# Altium project EBC.PrjPCB
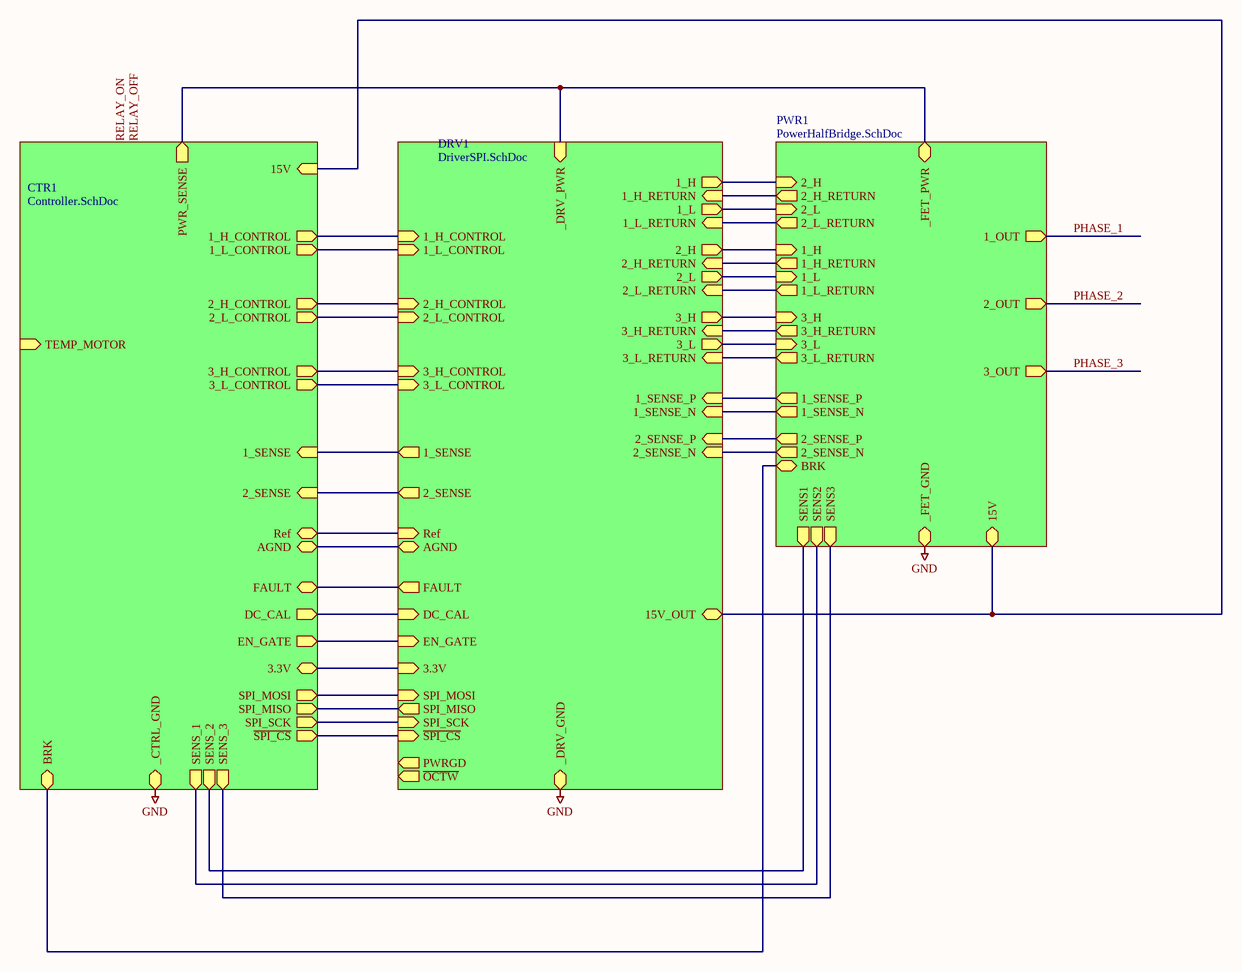
[diagram p0: Main.SchDoc]
4 sheets, 145 parts. Net scope: hierarchical (ports join the sheet entries above them; power ports are global).
Board file: EBC.PcbDoc
Sheets:
  Main.SchDoc
    PWR1 = PowerHalfBridge.SchDoc
    DRV1 = DriverSPI.SchDoc
    CTR1 = Controller.SchDoc

## Sheet Main.SchDoc
size A3; PageSetup: Record=PageOptions|CenterHorizontal=True|CenterVertical=True|PrintScale=0.67|XCorrection=1.00|YCorrection=1.00|PrintKind=2|BorderSize=5000000|LeftOffset=0|BottomOffset=0|Orientation=2|PaperLength=2970|PaperWidth=2100|Scale=100|PaperSource=7|PrintQuality=300|MediaType=1|DitherType=2|PrintScaleMode=1|PaperKind=A4|PaperIndex=9; Scale: 1:1; DocumentType: Схема электрическая принципиальная; FirstReferrence: АБВГ.123456.001

### Sub-sheets
CTR1 = Controller.SchDoc: FAULT, 1_L_CONTROL (out), 2_L_CONTROL (out), 3_L_CONTROL (out), DC_CAL (out), SPI_SCK (out), PWR_SENSE (out), 3_H_CONTROL (out), 2_H_CONTROL (out), 1_H_CONTROL (out), SPI_MOSI (out), ~{SPI_CS} (out), 1_SENSE (in), 2_SENSE (in), 15V (in), EN_GATE (out), _CTRL_GND, 3.3V, Ref, AGND, SPI_MISO (out), SENS_1 (out), SENS_2 (out), SENS_3 (out), TEMP_MOTOR (in), BRK
DRV1 = DriverSPI.SchDoc: 2_H (out), 1_H (out), 3_H (out), 2_L (out), 1_L (out), 3_L (out), 1_SENSE_P (in), 1_SENSE_N (in), 2_SENSE_P (in), 2_SENSE_N (in), 2_H_RETURN (in), 2_L_RETURN (in), 1_H_RETURN (in), 3_H_RETURN (in), 1_L_RETURN (in), 3_L_RETURN (in), 2_H_CONTROL (in), 2_L_CONTROL (in), 1_H_CONTROL (in), 1_L_CONTROL (in), 3_H_CONTROL (in), 3_L_CONTROL (in), 1_SENSE (out), 2_SENSE (out), _DRV_PWR (in), _DRV_GND (bidir), Ref (in), AGND (bidir), 15V_OUT, FAULT (out), EN_GATE (in), DC_CAL (in), 3.3V (in), SPI_MOSI (in), SPI_MISO (out), ~{SPI_CS} (in), SPI_SCK (in), PWRGD (out), ~{OCTW} (out)
PWR1 = PowerHalfBridge.SchDoc: 1_H (in), 2_H (in), 3_H (in), 1_L (in), 2_L (in), 3_L (in), 1_SENSE_P (out), 1_SENSE_N (out), 2_SENSE_N (out), 2_SENSE_P (out), _FET_PWR, _FET_GND, 1_OUT (out), 2_OUT (out), 3_OUT (out), 1_H_RETURN (out), 1_L_RETURN (out), 2_H_RETURN (out), 3_H_RETURN (out), 2_L_RETURN (out), 3_L_RETURN (out), SENS1 (out), SENS2 (out), SENS3 (out), 15V, BRK

### Nets
GND: sheet PWR1/_FET_GND, sheet PWR1/2_L_RETURN, sheet DRV1/1_L_RETURN, sheet DRV1/_DRV_GND, sheet CTR1/_CTRL_GND  [project net _CTRL_GND]
1_H_CONTROL: sheet DRV1/1_H_CONTROL, sheet CTR1/1_H_CONTROL
1_L_CONTROL: sheet DRV1/1_L_CONTROL, sheet CTR1/1_L_CONTROL
1_SENSE: sheet DRV1/1_SENSE, sheet CTR1/1_SENSE
2_H_CONTROL: sheet DRV1/2_H_CONTROL, sheet CTR1/2_H_CONTROL
2_L_CONTROL: sheet DRV1/2_L_CONTROL, sheet CTR1/2_L_CONTROL
2_SENSE: sheet DRV1/2_SENSE, sheet CTR1/2_SENSE
3_H_CONTROL: sheet DRV1/3_H_CONTROL, sheet CTR1/3_H_CONTROL
3_L_CONTROL: sheet DRV1/3_L_CONTROL, sheet CTR1/3_L_CONTROL
_3.3V: sheet DRV1/3.3V, sheet CTR1/3.3V
_AGND: sheet DRV1/AGND, sheet CTR1/AGND
_REF: sheet DRV1/Ref, sheet CTR1/Ref
BUCK: sheet PWR1/15V, sheet DRV1/15V_OUT, sheet CTR1/15V
DC_CAL: sheet DRV1/DC_CAL, sheet CTR1/DC_CAL
EN_GATE: sheet DRV1/EN_GATE, sheet CTR1/EN_GATE
FAULT: sheet DRV1/FAULT, sheet CTR1/FAULT
PHASE_1: sheet PWR1/1_OUT, sheet PWR1/1_H_RETURN, sheet DRV1/2_H_RETURN
PHASE_2: sheet PWR1/2_OUT, sheet PWR1/2_H_RETURN, sheet DRV1/1_H_RETURN
PHASE_3: sheet PWR1/3_OUT, sheet PWR1/3_H_RETURN, sheet DRV1/3_H_RETURN
~{SPI_CS}: sheet DRV1/~{SPI_CS}, sheet CTR1/~{SPI_CS}
SPI_MISO: sheet DRV1/SPI_MISO, sheet CTR1/SPI_MISO
SPI_MOSI: sheet DRV1/SPI_MOSI, sheet CTR1/SPI_MOSI
SPI_SCK: sheet DRV1/SPI_SCK, sheet CTR1/SPI_SCK
UH_P: sheet PWR1/1_H, sheet DRV1/2_H
UL_N: sheet PWR1/1_L_RETURN, sheet DRV1/2_L_RETURN
UL_P: sheet PWR1/1_L, sheet DRV1/2_L
VH_P: sheet PWR1/2_H, sheet DRV1/1_H
VL_P: sheet PWR1/2_L, sheet DRV1/1_L
WH_P: sheet PWR1/3_H, sheet DRV1/3_H
WL_N: sheet PWR1/3_L_RETURN, sheet DRV1/3_L_RETURN
WL_P: sheet PWR1/3_L, sheet DRV1/3_L
NetC46_2: sheet PWR1/_FET_PWR, sheet DRV1/_DRV_PWR, sheet CTR1/PWR_SENSE
NetIC1_14: sheet PWR1/SENS2, sheet CTR1/SENS_1
NetIC1_15: sheet PWR1/SENS1, sheet CTR1/SENS_2
NetIC1_16: sheet PWR1/SENS3, sheet CTR1/SENS_3
NetIC1_62: sheet PWR1/BRK, sheet CTR1/BRK
NetNT2_1: sheet PWR1/1_SENSE_P, sheet DRV1/1_SENSE_P
NetNT3_1: sheet PWR1/1_SENSE_N, sheet DRV1/1_SENSE_N
NetNT4_1: sheet PWR1/2_SENSE_P, sheet DRV1/2_SENSE_P
NetNT5_1: sheet PWR1/2_SENSE_N, sheet DRV1/2_SENSE_N

### Notes on the sheet
- Labels drawn without touching a wire or pin: RELAY_OFF, RELAY_ON
- Title
- Size:
- Date:
- A3
- Number:
- Time:
- Revision:
- Sheet
- of
- File:

## Sheet PowerHalfBridge.SchDoc
size A3
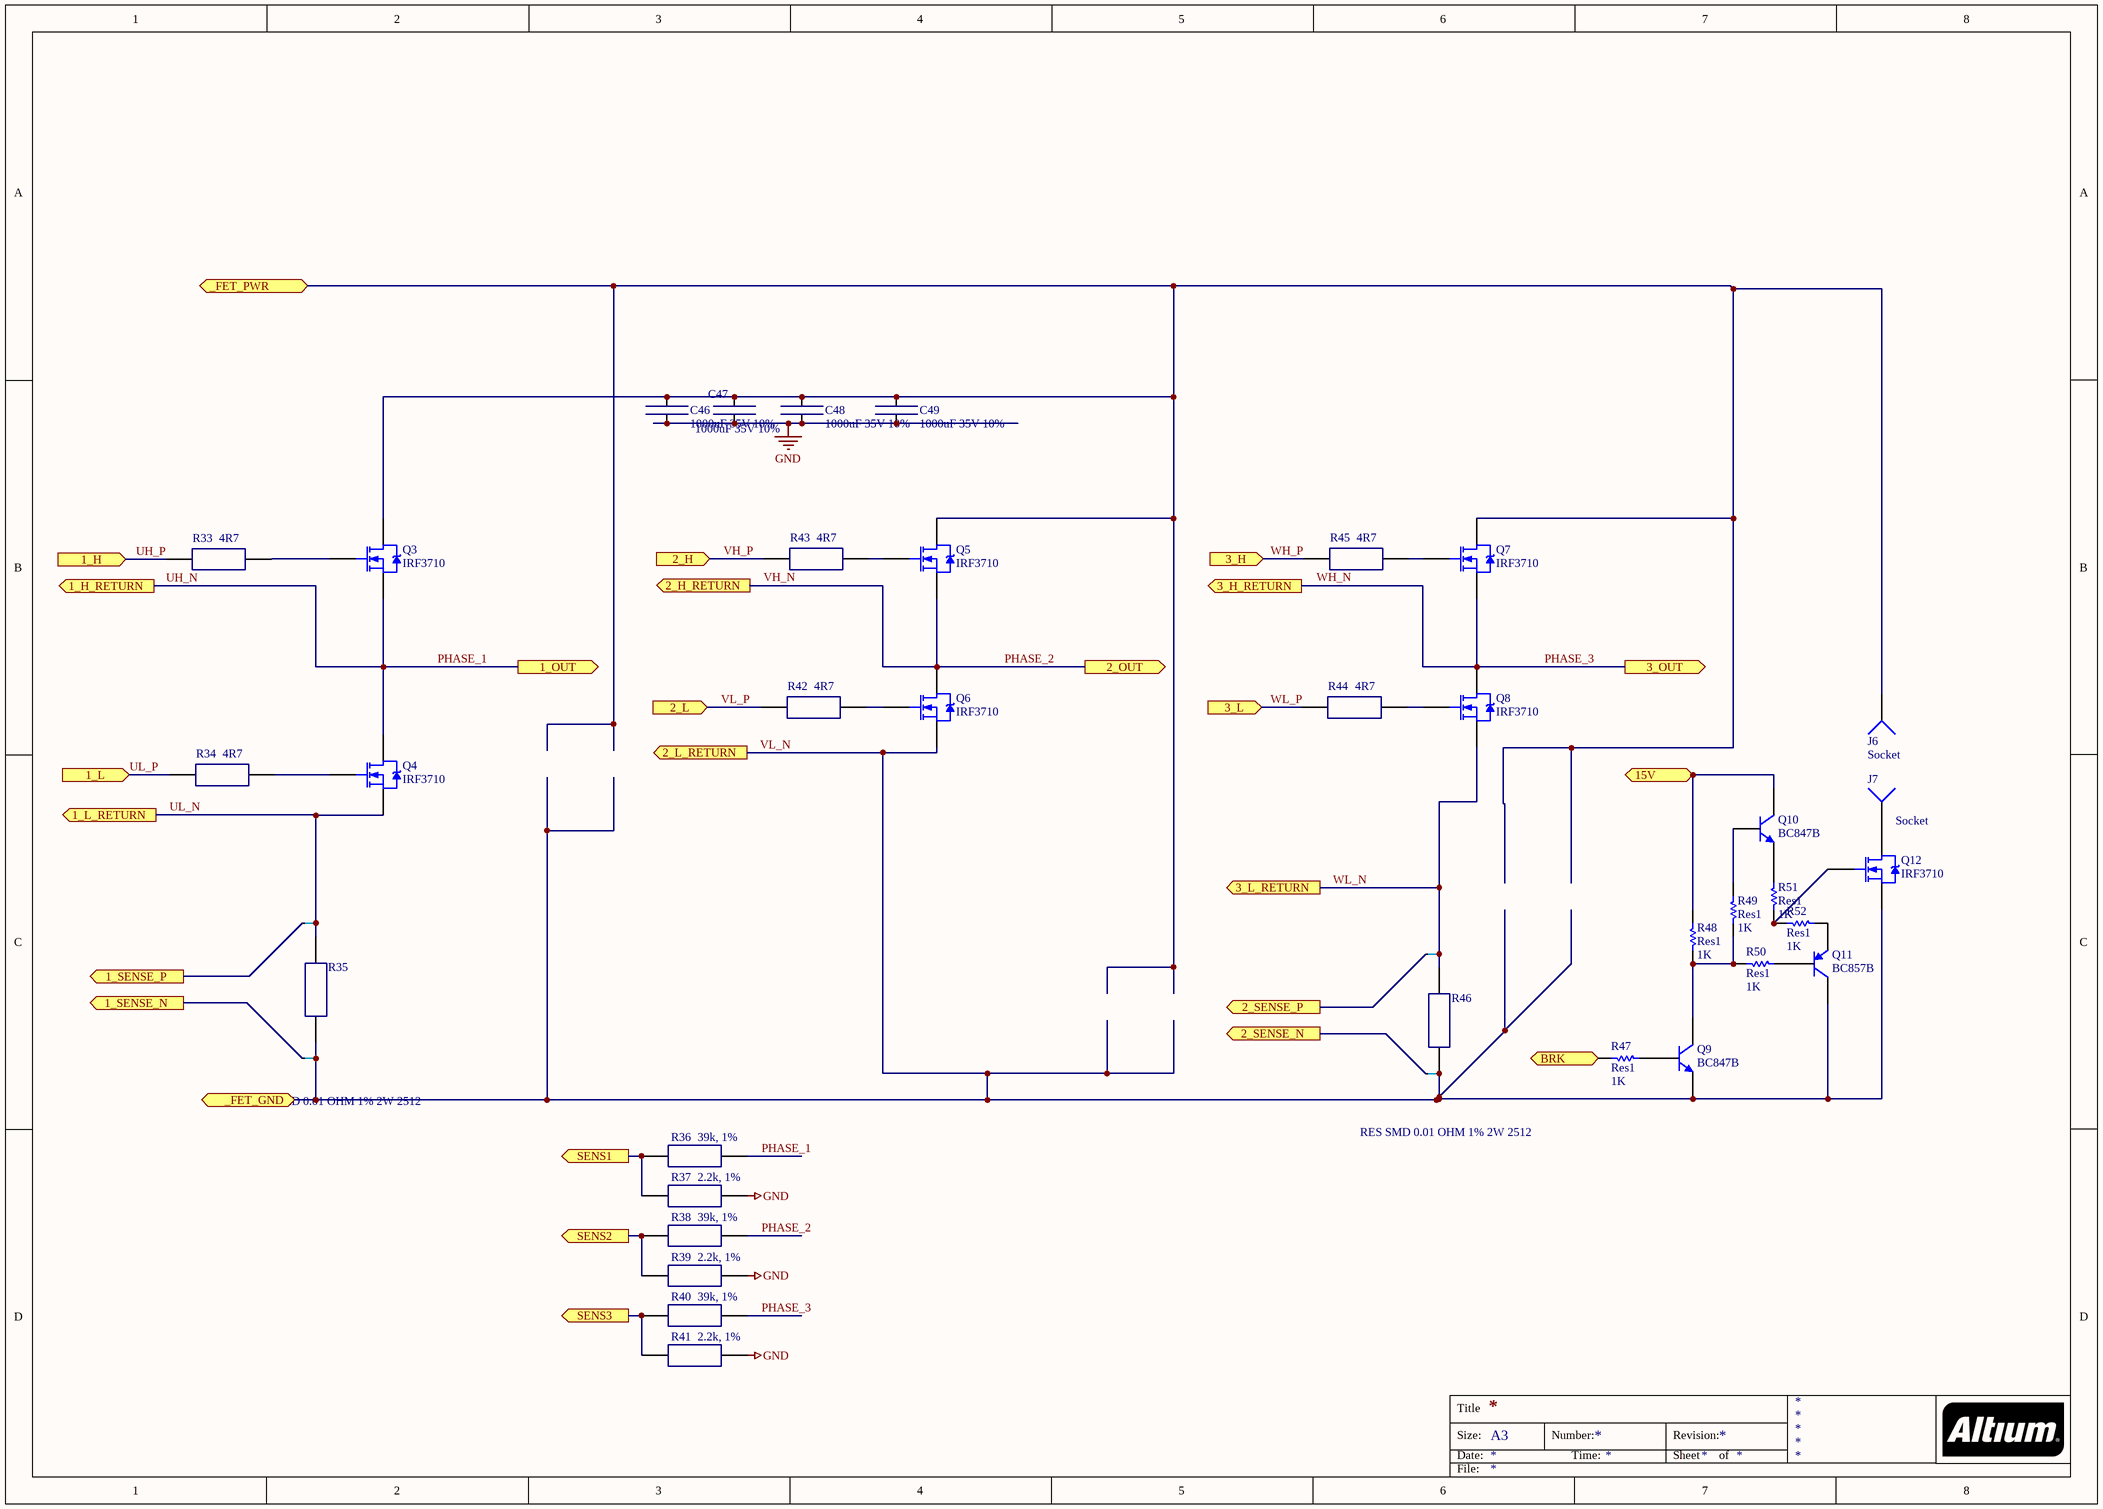
[diagram p1: PowerHalfBridge.SchDoc]

### Parts
C46  1000uF 35V 10%  [CAP_1mF_63V]
C47  1000uF 35V 10%  [CAP_1mF_63V]
C48  1000uF 35V 10%  [CAP_1mF_63V]
C49  1000uF 35V 10%  [CAP_1mF_63V]
J6  Socket  [PIN1]
J7  Socket  [PIN1]
NT2  NET_TIE  [NET_TIE_10mil]  (value not drawn)  (net tie, no BOM)
NT3  NET_TIE  [NET_TIE_10mil]  (value not drawn)  (net tie, no BOM)
NT4  NET_TIE  [NET_TIE_10mil]  (value not drawn)  (net tie, no BOM)
NT5  NET_TIE  [NET_TIE_10mil]  (value not drawn)  (net tie, no BOM)
Q3  IRF3710  [TO-220AB_LOW]
Q4  IRF3710  [TO-220AB_LOW]
Q5  IRF3710  [TO-220AB_LOW]
Q6  IRF3710  [TO-220AB_LOW]
Q7  IRF3710  [TO-220AB_LOW]
Q8  IRF3710  [TO-220AB_LOW]
Q9  BC847B  [SOT23_N]
Q10  BC847B  [SOT23_N]
Q11  BC857B  [SOT-23A_N]
Q12  IRF3710  [TO-220AB_LOW]
R33  4R7  [0603x]
R34  4R7  [RESC1608X05N(0603)]
R35  RES SMD 0.01 OHM 1% 2W 2512  [1T-2512]
R36  39k, 1%  [0805x]
R37  2.2k, 1%  [0805x]
R38  39k, 1%  [0805x]
R39  2.2k, 1%  [0805x]
R40  39k, 1%  [0805x]
R41  2.2k, 1%  [0805x]
R42  4R7  [RESC1608X05N(0603)]
R43  4R7  [RESC1608X05N(0603)]
R44  4R7  [RESC1608X05N(0603)]
R45  4R7  [RESC1608X05N(0603)]
R46  RES SMD 0.01 OHM 1% 2W 2512  [1T-2512]
R47  Res1  value 1K  [0603x]
R48  Res1  value 1K  [0603x]
R49  Res1  value 1K  [0603x]
R50  Res1  value 1K  [0603x]
R51  Res1  value 1K  [0603x]
R52  Res1  value 1K  [0603x]

### Ports
1_H (in), 1_H_RETURN (out), 1_L (in), 1_L_RETURN (out), 1_OUT (out), 1_SENSE_N (out), 1_SENSE_P (out), 2_H (in), 2_H_RETURN (out), 2_L (in), 2_L_RETURN (out), 2_OUT (out), 2_SENSE_N (out), 2_SENSE_P (out), 3_H (in), 3_H_RETURN (out), 3_L (in), 3_L_RETURN (out), 3_OUT (out), 15V, _FET_GND, _FET_PWR, BRK, SENS1 (out), SENS2 (out), SENS3 (out)

### Nets
GND: C46.1 C47.2 C48.1 C49.2 NT3.2 NT5.2 Q6.3(S) Q9.2(E) Q11.3(C) Q12.3(S) R35.2 R37.2 R39.2 R41.2 R46.2 ; port 2_L_RETURN, port _FET_GND  [also labelled VL_N]  [project net _CTRL_GND]
BUCK: Q10.3(C) R48.1 ; port 15V
PHASE_1: Q3.3(S) Q4.2(D) R36.2 ; port 1_H_RETURN, port 1_OUT  [also labelled UH_N]
PHASE_2: Q5.3(S) Q6.2(D) R38.2 ; port 2_OUT, port 2_H_RETURN  [also labelled VH_N]
PHASE_3: Q7.3(S) Q8.2(D) R40.2 ; port 3_OUT, port 3_H_RETURN  [also labelled WH_N]
UH_P: R33.1 ; port 1_H
UL_N: NT2.2 Q4.3(S) R35.1 ; port 1_L_RETURN
UL_P: R34.1 ; port 1_L
VH_P: R43.1 ; port 2_H
VL_P: R42.1 ; port 2_L
WH_P: R45.1 ; port 3_H
WL_N: NT4.2 Q8.3(S) R46.1 ; port 3_L_RETURN
WL_P: R44.1 ; port 3_L
NetC46_2: C46.2 C47.1 C48.2 C49.1 J6.1 Q3.2(D) Q5.2(D) Q7.2(D) ; port _FET_PWR
NetIC1_14: R38.1 R39.1 ; port SENS2
NetIC1_15: R36.1 R37.1 ; port SENS1
NetIC1_16: R40.1 R41.1 ; port SENS3
NetIC1_62: R47.1 ; port BRK
NetJ7_1: J7.1 Q12.2(D)
NetNT2_1: NT2.1 ; port 1_SENSE_P
NetNT3_1: NT3.1 ; port 1_SENSE_N
NetNT4_1: NT4.1 ; port 2_SENSE_P
NetNT5_1: NT5.1 ; port 2_SENSE_N
NetQ3_1: Q3.1(G) R33.2
NetQ4_1: Q4.1(G) R34.2
NetQ5_1: Q5.1(G) R43.2
NetQ6_1: Q6.1(G) R42.2
NetQ7_1: Q7.1(G) R45.2
NetQ8_1: Q8.1(G) R44.2
NetQ9_1: Q9.1(B) R47.2
NetQ9_3: Q9.3(C) R48.2 R49.2 R50.1
NetQ10_1: Q10.1(B) R49.1
NetQ10_2: Q10.2(E) R51.2
NetQ11_1: Q11.1(B) R50.2
NetQ11_2: Q11.2(E) R52.2
NetQ12_1: Q12.1(G) R51.1 R52.1

### Notes on the sheet
- Title
- Size:
- Date:
- A3
- Number:
- Time:
- Revision:
- Sheet
- of
- File:

### Library data of the parts
C46-C49 = Ceramic Chip Capacitor: Value: CAP CER 0.022UF 50V X7R 0402; Order Number: GRM155R71H223KA12D; Distributor: Murata Electronics; Package: 0402
NT2-NT5 = Net tie
Q3-Q8 Q12 = IRF3710: HEXFET Power MOSFET; Note: Pin 2 is electrically connected to pin 4.; Sim Note: Thermal Model provided is not called on from main Subckt.; Published: 8-Jun-2000; LatestRevisionDate: 17-Jul-2002; LatestRevisionNote: Re-released for DXP Platform.; DatasheetVersion: May-1998; PackageVersion: Feb-1997; PackageReference: TO-220AB; Publisher: Altium Limited; PackageDescription: TO, Thru-Hole, Vertical, Heatsink Mounted; 3 In-Line Leads; Pitch 2.54 mm; ComponentLink1Description: Manufacturer Link; ComponentLink1URL: http://www.irf.com/; ComponentLink2Description: Datasheet; ComponentLink2URL: http://www.irf.com/product-info/datasheets/data/irf3710.pdf
Q9 Q10 = BC847B: NPN General-purpose Transistor; Published: 17-Sep-2003; LatestRevisionDate: 12-Dec-2006; LatestRevisionNote: IPC-7351 Footprint Added.; DatasheetVersion: 4-Feb-2002; PackageVersion: May-1999; PackageReference: SOT23; Publisher: Altium Limited; PackageDescription: 3-Pin SOT-23 Package 0.95 mm Pitch, 2.3 mm Lead Span; ComponentLink1Description: Manufacturer Link; ComponentLink1URL: http://www.semiconductors.philips.com/; ComponentLink2Description: Datasheet; ComponentLink2URL: http://www.semiconductors.philips.com/acrobat/datasheets/BC846_BC847_BC848_5.pdf
Q11 = BC857B: PNP General Purpose Amplifier; Published: 8-Jun-2000; LatestRevisionDate: 20-Nov-2009; LatestRevisionNote: IPC-7351 Footprint Added.; DatasheetVersion: 1997; PackageVersion: Sep-1998; PackageReference: SOT-23A; Publisher: Altium Limited; PackageDescription: 3-Pin SOT-23 Package 0.95 mm Pitch, 2.3 mm Lead Span; ComponentLink1Description: Manufacturer Link; ComponentLink1URL: http://www.fairchildsemi.com/; ComponentLink2Description: Datasheet; ComponentLink2URL: http://www.fairchildsemi.com/ds/BC%2FBC857.pdf
R33 R34 R42-R45 = SMD: Value: RES SMD 4.7 OHM 5% 1/10W 0603; Order Number: ERJ-3GEYJ4R7V; Distributor: Panasonic
  R33 R34 R42 R44 R45: Package: RESC1608X05N(0603)
  R43: Package: 0603
R35 R46 = SMD: Order Number: WSL2512R0100FEA; Value: RES SMD 0.01 OHM 1% 2W 2512; Package: 2512; Distributor: Vishay Dale
R36 R38 R40 = SMD: Order Number: ERJ-3EKF3902V; Value: 39k, 1%; Package: RESC1608X05N(0603); Distributor: Panasonic
R37 R39 R41 = SMD: Order Number: ERJ-3EKF2201V; Value: 2.2k, 1%; Package: RESC1608X05N(0603); Distributor: Panasonic
R47-R52 = Res1: Resistor; Published: 8-Jun-2000; LatestRevisionDate: 17-Jul-2002; LatestRevisionNote: Re-released for DXP Platform.; PackageReference: AXIAL-0.3; Publisher: Altium Limited; PackageDescription: Axial Device, Thru-Hole; 2 Leads; 0.3 in Pin Spacing
J6 J7 = Socket: LatestRevisionDate: 17-Jul-2002; LatestRevisionNote: Re-released for DXP Platform.; Publisher: Altium Limited

## Sheet DriverSPI.SchDoc
size A4
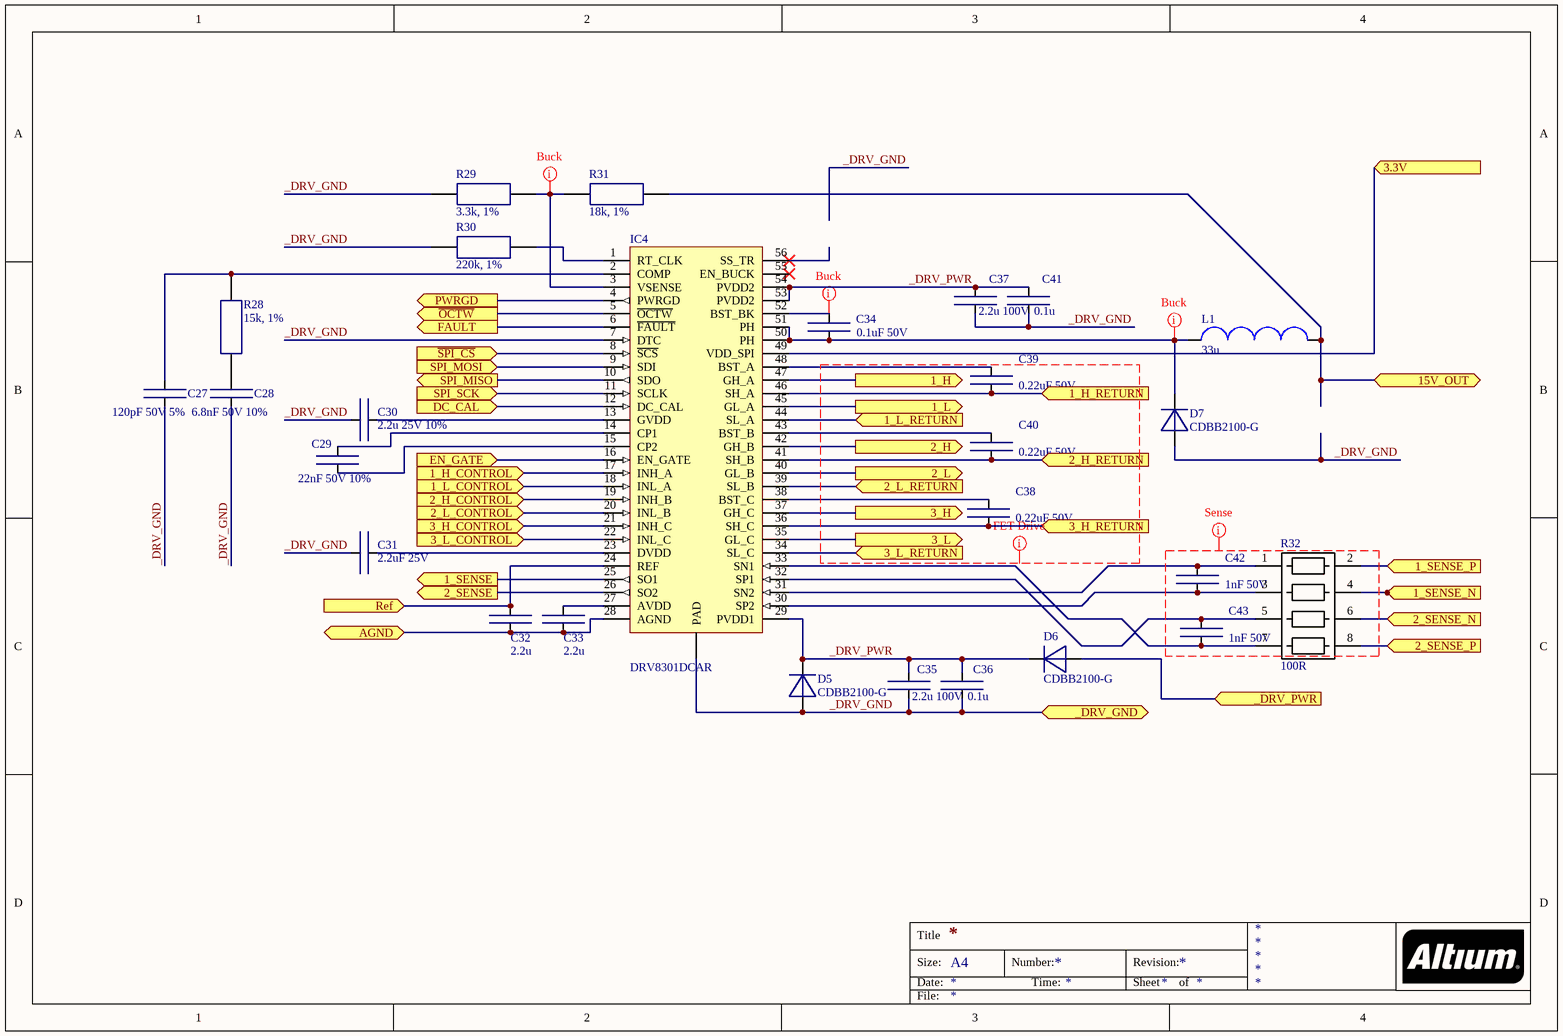
[diagram p2: DriverSPI.SchDoc]

### Parts
C27  120pF 50V 5%  [0402small]
C28  6.8nF 50V 10%  [0402small]
C29  22nF 50V 10%  [0402small]
C30  2.2u 25V 10%  [CAPC1608X08N(0603)]
C31  2.2uF 25V  [0603x]
C32  2.2u  [0603x]
C33  2.2u  [CAPC1608X08N(0603)]
C34  0.1uF 50V  [0402small]
C35  2.2u 100V  [EIA CC1210]
C36  0.1u  [C0805]
C37  2.2u 100V  [EIA CC1210]
C38  0.22uF 50V  [0402small]
C39  0.22uF 50V  [0402small]
C40  0.22uF 50V  [0402small]
C41  0.1u  [C0805]
C42  1nF 50V  [0402small]
C43  1nF 50V  [0402small]
D5  CDBB2100-G  [SMB_real]
D6  CDBB2100-G  [SMB_real]
D7  CDBB2100-G  [SMB_real]
IC4  DRV8301DCAR  [HTSSOP56(L)]
L1  33u  [DR74]
R28  15k, 1%  [0402small]
R29  3.3k, 1%  [0402small]
R30  220k, 1%  [0402small]
R31  18k, 1%  [0402small]
R32  100R  [RES_ARRAY_4X]

### Ports
1_H (out), 1_H_CONTROL (in), 1_H_RETURN (in), 1_L (out), 1_L_CONTROL (in), 1_L_RETURN (in), 1_SENSE (out), 1_SENSE_N (in), 1_SENSE_P (in), 2_H (out), 2_H_CONTROL (in), 2_H_RETURN (in), 2_L (out), 2_L_CONTROL (in), 2_L_RETURN (in), 2_SENSE (out), 2_SENSE_N (in), 2_SENSE_P (in), 3.3V (in), 3_H (out), 3_H_CONTROL (in), 3_H_RETURN (in), 3_L (out), 3_L_CONTROL (in), 3_L_RETURN (in), 15V_OUT, _DRV_GND (bidir), _DRV_PWR (in), AGND (bidir), DC_CAL (in), EN_GATE (in), FAULT (out), PWRGD (out), Ref (in), SPI_MISO (out), SPI_MOSI (in), SPI_SCK (in), ~{OCTW} (out), ~{SPI_CS} (in)

### Nets
_DRV_GND: C27.1 C28.1 C30.1 C31.2 C35.2 C36.2 C37.2 C41.2 D5.1 D7.1 IC4.7(DTC) IC4.44(SL_A) IC4.57(PAD) R29.2 R30.2 ; port 1_L_RETURN, port _DRV_GND  [project net _CTRL_GND]
1_H_CONTROL: IC4.17(INH_A) ; port 1_H_CONTROL
1_L_CONTROL: IC4.18(INL_A) ; port 1_L_CONTROL
1_SENSE: IC4.25(SO1) ; port 1_SENSE
2_H_CONTROL: IC4.19(INH_B) ; port 2_H_CONTROL
2_L_CONTROL: IC4.20(INL_B) ; port 2_L_CONTROL
2_SENSE: IC4.26(SO2) ; port 2_SENSE
3_H_CONTROL: IC4.21(INH_C) ; port 3_H_CONTROL
3_L_CONTROL: IC4.22(INL_C) ; port 3_L_CONTROL
_3.3V: IC4.49(VDD_SPI) ; port 3.3V
_AGND: C32.2 C33.2 IC4.28(AGND) ; port AGND
_DRV_PWR: C35.1 C36.1 C37.1 C41.1 D5.2 D6.2 IC4.29(PVDD1) IC4.53(PVDD2) IC4.54(PVDD2)
_REF: C32.1 IC4.24(REF) ; port Ref
BUCK: L1.2 R31.1 ; port 15V_OUT
DC_CAL: IC4.12(DC_CAL) ; port DC_CAL
EN_GATE: IC4.16(EN_GATE) ; port EN_GATE
FAULT: IC4.6(~{FAULT}) ; port FAULT
PHASE_1: C40.1 IC4.41(SH_B) ; port 2_H_RETURN
PHASE_2: C39.1 IC4.46(SH_A) ; port 1_H_RETURN
PHASE_3: C38.1 IC4.36(SH_C) ; port 3_H_RETURN
~{SPI_CS}: IC4.8(~{SCS}) ; port ~{SPI_CS}
SPI_MISO: IC4.10(SDO) ; port SPI_MISO
SPI_MOSI: IC4.9(SDI) ; port SPI_MOSI
SPI_SCK: IC4.11(SCLK) ; port SPI_SCK
UH_P: IC4.42(GH_B) ; port 2_H
UL_N: IC4.39(SL_B) ; port 2_L_RETURN
UL_P: IC4.40(GL_B) ; port 2_L
VH_P: IC4.47(GH_A) ; port 1_H
VL_P: IC4.45(GL_A) ; port 1_L
WH_P: IC4.37(GH_C) ; port 3_H
WL_N: IC4.34(SL_C) ; port 3_L_RETURN
WL_P: IC4.35(GL_C) ; port 3_L
NetC27_2: C27.2 IC4.2(COMP) R28.2
NetC28_2: C28.2 R28.1
NetC29_1: C29.1 IC4.14(CP1)
NetC29_2: C29.2 IC4.15(CP2)
NetC30_2: C30.2 IC4.13(GVDD)
NetC31_1: C31.1 IC4.23(DVDD)
NetC33_1: C33.1 IC4.27(AVDD)
NetC34_1: C34.1 D7.2 IC4.50(PH) IC4.51(PH) L1.1
NetC34_2: C34.2 IC4.52(BST_BK)
NetC38_2: C38.2 IC4.38(BST_C)
NetC39_2: C39.2 IC4.48(BST_A)
NetC40_2: C40.2 IC4.43(BST_B)
NetC42_1: C42.1 IC4.30(SP2) R32.3
NetC42_2: C42.2 IC4.31(SN2) R32.1
NetC43_1: C43.1 IC4.33(SN1) R32.7
NetC43_2: C43.2 IC4.32(SP1) R32.5
NetC46_2: D6.1 ; port _DRV_PWR
NetIC4_1: IC4.1(RT_CLK) R30.1
NetIC4_3: IC4.3(VSENSE) R29.1 R31.2
NetIC4_4: IC4.4(PWRGD) ; port PWRGD
NetIC4_5: IC4.5(~{OCTW}) ; port ~{OCTW}
NetNT2_1: R32.2 ; port 1_SENSE_P
NetNT3_1: R32.4 ; port 1_SENSE_N
NetNT4_1: R32.8 ; port 2_SENSE_P
NetNT5_1: R32.6 ; port 2_SENSE_N

Not connected (* = marked no-connect by the designer): IC4 55(EN_BUCK)* 56(SS_TR)*

### Layout directives
net class Sense: (no net found under the mark)
net class FET Drive: (no net found under the mark)
net class Buck: NetC34_1, NetC34_2, NetIC4_3

### Notes on the sheet
- Title
- Size:
- Date:
- A4
- Number:
- Time:
- Revision:
- Sheet
- of
- File:

### Library data of the parts
C27 = Ceramic Chip Capacitor: Value: CAP CER 120PF 50V NP0 0402; Order Number: C0402C121J5GACTU; Distributor: Panasonic; Package: 0402
C28 = Ceramic Chip Capacitor: Value: CAP CER 6800PF 50V X7R 0402; Order Number: GRM155R71H682KA88D; Distributor: Murata; Package: 0402
C29 = Ceramic Chip Capacitor: as C46 on sheet PowerHalfBridge; Distributor: Murata Electronics; Package: 0402
C30-C33 = Ceramic Chip Capacitor: Value: CAP CER 2.2UF 25V X5R 0603; Order Number: GRM188R61E225KA12D; Distributor: Murata Electronics; Package: 0603
C34 = Ceramic Chip Capacitor: Value: CAP CER 0.1UF 50V X5R 0402; Order Number: C1005X5R1H104K050BB; Distributor: TDK Corporation; Package: 0402
C35 C37 = Ceramic Chip Capacitor: Value: CAP CER 2.2UF 100V X7R 1210; Order Number: C1210X225K1RACAUTO; Distributor: KEMET; Package: 1210
C36 C41 = Ceramic Chip Capacitor: Value: CAP CER 0.1UF 100V X7R 0805; Order Number: C0805C104K1RACTU; Distributor: KEMET; Package: 0805
C38-C40 = Ceramic Chip Capacitor: Value: CAP CER 0.22UF 50V X5R 0402; Order Number: UMK105BJ224KV-F; Distributor: Taiyo Yuden; Package: 0402
C42 C43 = Ceramic Chip Capacitor: Value: CAP CER 1000PF 50V C0G 0402; Order Number: CGA2B2C0G1H102J050BD; Distributor: TDK Corporation; Package: 0402
D5-D7 = ES1A...D: Value: SCHOTTKY 100V 2A DO214AA; Order Number: CDBB2100-G; Distributor: Comchip Technology; Package: SMB
IC4 = DRV8301: Value: DRV 8301 - IC MOTOR CONTROLLER SPI 56HTSSOP; Distributor: Texas Instruments; Order Number: DRV8301DCAR; Package: HTSSOP56
L1 = DR74: Value: FIXED IND 33UH 1.41A 143 MOHM; Order Number: DR74-330-R; Distributor: Eaton; Package: Nonstandard
R28 = SMD: Value: RES SMD 15K OHM 1% 1/10W 0402; Order Number: ERJ-2RKF1502X; Package: 0402; Distributor: Panasonic
R29 = SMD: Value: RES SMD 3.3K OHM 1% 1/10W 0402; Order Number: ERJ-2RKF3301X; Package: 0402; Distributor: Panasonic
R30 = SMD: Value: RES SMD 220K OHM 1% 1/10W 0402; Order Number: ERJ-2RKF2203X; Package: 0402; Distributor: Panasonic
R31 = SMD: Value: RES SMD 18K OHM 1% 1/10W 0402; Order Number: ERJ-2RKF1802X; Package: 0402; Distributor: Panasonic
R32 = RES_Array_4x: 742C0431000FP; Order Number: EXB-38V101JV; Value: RES ARRAY 4 RES 100 OHM 1206; Distributor: Panasonic; Package: 1206 (3216 Metric)

## Sheet Controller.SchDoc
size A2
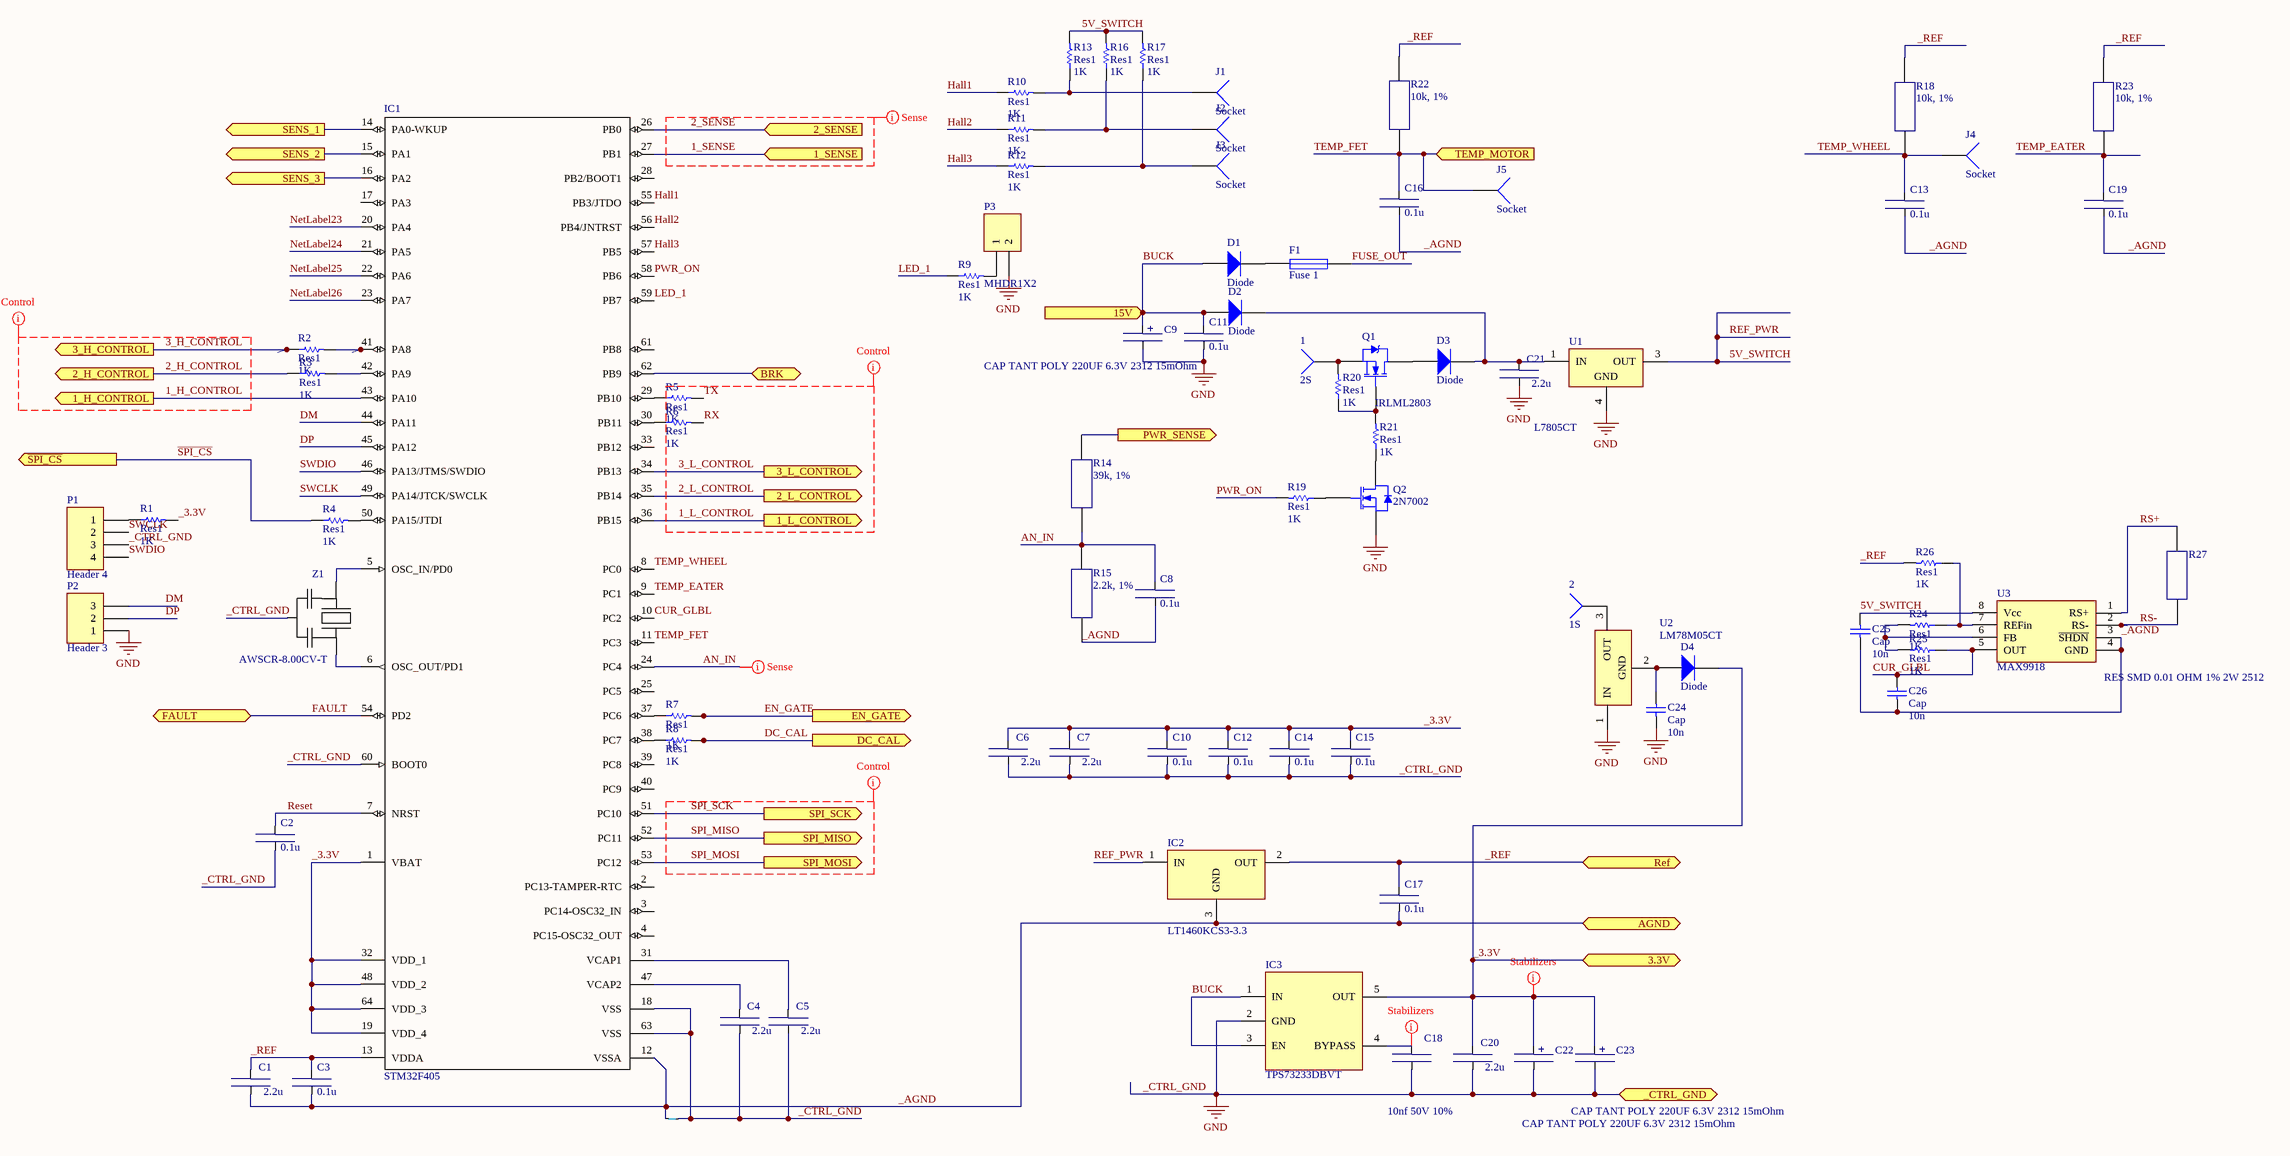
[diagram p3: Controller.SchDoc]

### Parts
1  2S  [PIN1]
2  1S  [PIN1]
C1  2.2u  [ERA-0603]
C2  0.1u  [CAPC1608X08N(0603)]
C3  0.1u  [ERA-0603]
C4  2.2u  [CAPC1608X08N(0603)]
C5  2.2u  [CAPC1608X08N(0603)]
C6  2.2u  [CAPC1608X08N(0603)]
C7  2.2u  [CAPC1608X08N(0603)]
C8  0.1u  [0603x]
C9  CAP TANT POLY 220UF 6.3V 2312 15mOhm  [CAP_POLY_330]
C10  0.1u  [CAPC1608X08N(0603)]
C11  0.1u  [ERA-0603]
C12  0.1u  [CAPC1608X08N(0603)]
C13  0.1u  [0603x]
C14  0.1u  [CAPC1608X08N(0603)]
C15  0.1u  [CAPC1608X08N(0603)]
C16  0.1u  [CAPC1608X08N(0603)]
C17  0.1u  [0603x]
C18  10nf 50V 10%  [0603x]
C19  0.1u  [0603x]
C20  2.2u  [CAPC1608X08N(0603)]
C21  2.2u  [0603x]
C22  CAP TANT POLY 220UF 6.3V 2312 15mOhm  [C]
C23  CAP TANT POLY 220UF 6.3V 2312 15mOhm  [CAP_POLY_330]
C24  Cap  value 10n  [ERA-0603]
C25  Cap  value 10n  [ERA-0603]
C26  Cap  value 10n  [ERA-0603]
D1  Diode  [SMB_real]
D2  Diode  [SMA]
D3  Diode  [SMA]
D4  Diode  [SMA]
F1  Fuse 1  [1812]
IC1  STM32F405  [LQFP64_L]
IC2  LT1460KCS3-3.3  [SOT23-3_L]
IC3  TPS73233DBVT  [SOT23-5_L]
J1  Socket  [PIN1]
J2  Socket  [PIN1]
J3  Socket  [PIN1]
J4  Socket  [PIN1]
J5  Socket  [PIN1]
NT1  NET_TIE  [NET_TIE_10mil]  (value not drawn)  (net tie, no BOM)
P1  Header 4  [MHDR1X4]
P2  Header 3  [HDR1X3]
P3  MHDR1X2  [MHDR1X2]
Q1  IRLML2803  [SOT-23_N]
Q2  2N7002  [SOT23_N]
R1  Res1  value 1K  [0603x]
R2  Res1  value 1K  [1206x]
R3  Res1  value 1K  [0603x]
R4  Res1  value 1K  [0603x]
R5  Res1  value 1K  [0402x]
R6  Res1  value 1K  [0402x]
R7  Res1  value 1K  [0805x]
R8  Res1  value 1K  [0603x]
R9  Res1  value 1K  [0603x]
R10  Res1  value 1K  [0603x]
R11  Res1  value 1K  [0603x]
R12  Res1  value 1K  [0603x]
R13  Res1  value 1K  [0603x]
R14  39k, 1%  [1206x]
R15  2.2k, 1%  [0603x]
R16  Res1  value 1K  [0603x]
R17  Res1  value 1K  [0603x]
R18  10k, 1%  [0603x]
R19  Res1  value 1K  [0603x]
R20  Res1  value 1K  [0603x]
R21  Res1  value 1K  [0603x]
R22  10k, 1%  [RESC1608X05N(0603)]
R23  10k, 1%  [0603x]
R24  Res1  value 1K  [0603x]
R25  Res1  value 1K  [0603x]
R26  Res1  value 1K  [0603x]
R27  RES SMD 0.01 OHM 1% 2W 2512  [1T-2512]
U1  L7805CT  [TO-252AA]
U2  LM78M05CT  [318-08]
U3  MAX9918  [SO8_M]
Z1  AWSCR-8.00CV-T  [CRYSTAL_CERAMIC]

### Ports
1_H_CONTROL (out), 1_L_CONTROL (out), 1_SENSE (in), 2_H_CONTROL (out), 2_L_CONTROL (out), 2_SENSE (in), 3.3V, 3_H_CONTROL (out), 3_L_CONTROL (out), 15V (in), _CTRL_GND, AGND, BRK, DC_CAL (out), EN_GATE (out), FAULT, PWR_SENSE (out), Ref, SENS_1 (out), SENS_2 (out), SENS_3 (out), SPI_MISO (out), SPI_MOSI (out), SPI_SCK (out), TEMP_MOTOR (in), ~{SPI_CS} (out)

### Nets
_CTRL_GND: C2.2 C4.2 C5.2 C6.2 C7.2 C9.2 C10.2 C11.2 C12.2 C14.2 C15.2 C18.2 C20.2 C21.2 C22.2 C23.2 C24.2 IC1.18(VSS) IC1.60(BOOT0) IC1.63(VSS) IC3.2(GND) NT1.2 P1.3 P2.1 P3.2 Q2.2(S) U1.4(GND) U2.1(IN) Z1.2(GND) ; port _CTRL_GND  [also labelled GND]
1_H_CONTROL: IC1.43(PA10) ; port 1_H_CONTROL
1_L_CONTROL: IC1.36(PB15) ; port 1_L_CONTROL
1_SENSE: IC1.27(PB1) ; port 1_SENSE
2_H_CONTROL: R3.1 ; port 2_H_CONTROL
2_L_CONTROL: IC1.35(PB14) ; port 2_L_CONTROL
2_SENSE: IC1.26(PB0) ; port 2_SENSE
3_H_CONTROL: R2.1 ; port 3_H_CONTROL
3_L_CONTROL: IC1.34(PB13) ; port 3_L_CONTROL
5V_SWITCH: C25.1 IC2.1(IN) R13.2 R16.2 R17.2 U1.3(OUT) U3.8(Vcc)  [also labelled REF_PWR]
_3.3V: C6.1 C7.1 C10.1 C12.1 C14.1 C15.1 C20.1 C22.1 C23.1 D4.2(K) IC1.1(VBAT) IC1.19(VDD_4) IC1.32(VDD_1) IC1.48(VDD_2) IC1.64(VDD_3) IC3.5(OUT) R1.2 ; port 3.3V
_AGND: C1.2 C3.2 C8.2 C13.2 C16.2 C17.2 C19.2 C25.2 C26.2 IC1.12(VSSA) IC2.3(GND) NT1.1 R15.2 U3.3(~{SHDN}) U3.4(GND) ; port AGND
_REF: C1.1 C3.1 C17.1 IC1.13(VDDA) IC2.2(OUT) R18.1 R22.1 R23.1 R26.2 ; port Ref
AN_IN: C8.1 IC1.24(PC4) R14.2 R15.1
BUCK: C9.1 C11.1 D1.1(A) D2.1(A) IC3.1(IN) IC3.3(EN) ; port 15V
CUR_GLBL: C26.1 IC1.10(PC2) R25.1 U3.5(OUT)
DC_CAL: R8.2 ; port DC_CAL
DM: IC1.44(PA11) P2.3
DP: IC1.45(PA12) P2.2
EN_GATE: R7.2 ; port EN_GATE
FAULT: IC1.54(PD2) ; port FAULT
FUSE_OUT: F1.2
Hall1: IC1.55(PB3/JTDO) R10.1
Hall2: IC1.56(PB4/JNTRST) R11.1
Hall3: IC1.57(PB5) R12.1
LED_1: IC1.59(PB7) R9.1
NetLabel23: IC1.20(PA4)
NetLabel24: IC1.21(PA5)
NetLabel25: IC1.22(PA6)
NetLabel26: IC1.23(PA7)
PWR_ON: IC1.58(PB6) R19.2
Reset: C2.1 IC1.7(NRST)
RS+: R27.1 U3.1(RS+)
RS-: R27.2 U3.2(RS-)
RX: R6.2
~{SPI_CS}: R4.1 ; port ~{SPI_CS}
SPI_MISO: IC1.52(PC11) ; port SPI_MISO
SPI_MOSI: IC1.53(PC12) ; port SPI_MOSI
SPI_SCK: IC1.51(PC10) ; port SPI_SCK
SWCLK: IC1.49(PA14/JTCK/SWCLK) P1.2
SWDIO: IC1.46(PA13/JTMS/SWDIO) P1.4
TEMP_EATER: C19.1 IC1.9(PC1) R23.2
TEMP_FET: C16.1 IC1.11(PC3) J5.1 R22.2 ; port TEMP_MOTOR
TEMP_WHEEL: C13.1 IC1.8(PC0) J4.1 R18.2
TX: R5.2
Net1_1: 1.1 Q1.2(S) R20.2
Net2_1: 2.1 U2.3(OUT)
NetC4_1: C4.1 IC1.47(VCAP2)
NetC5_1: C5.1 IC1.31(VCAP1)
NetC18_1: C18.1 IC3.4(BYPASS)
NetC21_1: C21.1 D2.2(K) D3.2(K) U1.1(IN)
NetC24_1: C24.1 D4.1(A) U2.2(GND)
NetC46_2: R14.1 ; port PWR_SENSE
NetD1_2: D1.2(K) F1.1
NetD3_1: D3.1(A) Q1.3(D)
NetIC1_5: IC1.5(OSC_IN/PD0) Z1.1(X1)
NetIC1_6: IC1.6(OSC_OUT/PD1) Z1.3(X2)
NetIC1_14: IC1.14(PA0-WKUP) ; port SENS_1
NetIC1_15: IC1.15(PA1) ; port SENS_2
NetIC1_16: IC1.16(PA2) ; port SENS_3
NetIC1_29: IC1.29(PB10) R5.1
NetIC1_30: IC1.30(PB11) R6.1
NetIC1_37: IC1.37(PC6) R7.1
NetIC1_38: IC1.38(PC7) R8.1
NetIC1_41: IC1.41(PA8) R2.2
NetIC1_42: IC1.42(PA9) R3.2
NetIC1_50: IC1.50(PA15/JTDI) R4.2
NetIC1_62: IC1.62(PB9) ; port BRK
NetJ1_1: J1.1 R10.2 R13.1
NetJ2_1: J2.1 R11.2 R16.1
NetJ3_1: J3.1 R12.2 R17.1
NetP1_1: P1.1 R1.1
NetP3_1: P3.1 R9.2
NetQ1_1: Q1.1(G) R20.1 R21.2
NetQ2_1: Q2.1(G) R19.1
NetQ2_3: Q2.3(D) R21.1
NetR24_1: R24.1 R26.1 U3.7(REFin)
NetR24_2: R24.2 R25.2 U3.6(FB)

Not connected (* = marked no-connect by the designer): IC1 2(PC13-TAMPER-RTC) 3(PC14-OSC32_IN) 4(PC15-OSC32_OUT) 17(PA3) 25(PC5) 28(PB2/BOOT1) 33(PB12) 39(PC8) 40(PC9) 61(PB8)

### Layout directives
net class Stabilizers: _3.3V, NetC18_1
net class Control: 1_H_CONTROL, 1_L_CONTROL, 2_H_CONTROL, 2_L_CONTROL, 3_H_CONTROL, 3_L_CONTROL, RX, SPI_MISO, SPI_MOSI, SPI_SCK, TX
net class Sense: 1_SENSE, 2_SENSE, AN_IN

### Notes on the sheet
- Title
- Size:
- Date:
- File:
- A2
- Number:
- Time:
- Revision:
- Sheet
- of

### Library data of the parts
1 2 = Socket: LatestRevisionDate: 17-Jul-2002; LatestRevisionNote: Re-released for DXP Platform.; Publisher: Altium Limited
C1 C4-C7 C20 C21 = Ceramic Chip Capacitor: as C30 on sheet DriverSPI; Distributor: Murata Electronics; Package: CAPC1608X08N(0603)
C2 C3 C8 C10-C17 C19 = Ceramic Chip Capacitor: Value: CAP CER 0.1UF 50V X7R 0603; Order Number: 06035C104KAT2A; Distributor: AVX Corporation
  C2 C3 C8 C11 C13 C16 C17 C19: Package: 0603
  C10 C12 C14 C15: Package: CAPC1608X08N(0603)
C9 C22 C23 = Tantalum Chip Capacitor: Order Number: T520C227M006ATE015; Value: CAP TANT POLY 220UF 6.3V 2312 15mOhm; Package: C; Distributor: KEMET
C18 = Ceramic Chip Capacitor: Value: CAP CER 10000PF 50V X7R 0402; Order Number: CGA2B3X7R1H103K050BD; Distributor: TDK Corporation; Package: 0402
C24-C26 = Cap: Capacitor; Published: 8-Jun-2000; LatestRevisionDate: 17-Jul-2002; LatestRevisionNote: Re-released for DXP Platform.; PackageReference: RAD-0.3; Publisher: Altium Limited; PackageDescription: Radial Cap, Thru-Hole; 2 Leads; 0.3 in Pin Spacing
D1-D4 = Diode: Default Diode; Published: 8-Jun-2000; LatestRevisionDate: 17-Jul-2002; LatestRevisionNote: Re-released for DXP Platform.; PackageVersion: Sep-1996; PackageReference: SMC; Publisher: Altium Limited; PackageDescription: DO-214-AB/SMC; 2 C-Bend Leads; Body 7.9 x 5.9 mm, inc. leads (LxW); Code_JEDEC: DO-214-AB
F1 = Fuse 1: Fuse; Published: 8-Jun-2000; LatestRevisionDate: 17-Jul-2002; LatestRevisionNote: Re-released for DXP Platform.; PackageReference: PIN-W2/E2.8; Publisher: Altium Limited; PackageDescription: Thru-Hole; 2 Leads
IC1 = STM32F405: STM32 ARM-based 32-bit MCU; Order Number: STM32F405RGT6; Value: STM32F405RGT6; Package: LQFP-64; Distributor: STMicroelectronics
IC2 = PreciseRef: Value: Voltage reference 3.3V 0.5% 50ppm/C; Order Number: LT1460KCS3-3.3#TRMPBF; Distrubutor: Linear Technology; Package: SOT23
IC3 = TPS7xx33: Value: LDO 3.3V 250mA; Order Number: TPS73233DBVT; Distributor: Texas Instruments; Package: SOT23-5
NT1 = Net tie
P1 = Header 4: Header, 4-Pin; LatestRevisionDate: 17-Jul-2002; LatestRevisionNote: Re-released for DXP Platform.; Publisher: Altium Limited
P2 = Header 3: Header, 3-Pin; LatestRevisionDate: 17-Jul-2002; LatestRevisionNote: Re-released for DXP Platform.; Publisher: Altium Limited
P3 = MHDR1X2: Header, 2-Pin; LatestRevisionDate: 17-Jul-2002; LatestRevisionNote: Re-released for DXP Platform.; Publisher: Altium Limited
Q1 = IRLML2803: HEXFET Power MOSFET; Published: 8-Jun-2000; LatestRevisionDate: 20-Nov-2009; LatestRevisionNote: IPC-7351 Footprint Added.; DatasheetVersion: Aug-1997; PackageReference: SOT-23; Publisher: Altium Limited; PackageDescription: 3-Pin SOT-23 Package 0.95 mm Pitch, 2.3 mm Lead Span; ComponentLink1Description: Manufacturer Link; ComponentLink1URL: http://www.irf.com/; ComponentLink2Description: Datasheet; ComponentLink2URL: http://www.irf.com/product-info/datasheets/data/irlml2803.pdf
Q2 = 2N7002: N-channel Enhancement Mode Field-effect Transistor; Published: 17-Sep-2003; LatestRevisionDate: 12-Dec-2006; LatestRevisionNote: IPC-7351 Footprint Added.; DatasheetVersion: 27-Jul-2000; PackageVersion: May-1999; PackageReference: SOT23; Publisher: Altium Limited; PackageDescription: 3-Pin SOT-23 Package 0.95 mm Pitch, 2.3 mm Lead Span; ComponentLink1Description: Manufacturer Link; ComponentLink1URL: http://www.semiconductors.philips.com/; ComponentLink2Description: Datasheet; ComponentLink2URL: http://www.semiconductors.philips.com/acrobat/datasheets/2N7002_4.pdf
R1-R13 R16 R17 R19-R21 R24-R26 = Res1: Resistor; Published: 8-Jun-2000; LatestRevisionDate: 17-Jul-2002; LatestRevisionNote: Re-released for DXP Platform.; PackageReference: AXIAL-0.3; Publisher: Altium Limited; PackageDescription: Axial Device, Thru-Hole; 2 Leads; 0.3 in Pin Spacing
R14 = SMD: Value: RES SMD 39K OHM 1% 1/10W 0603; Order Number: ERJ-3EKF3902V; Package: RESC1608X05N(0603); Distributor: Panasonic
R15 = SMD: Value: RES SMD 2.2K OHM 1% 1/10W 0603; Order Number: ERJ-3EKF2201V; Package: RESC1608X05N(0603); Distributor: Panasonic
R18 R22 R23 = SMD: Value: RES SMD 10K OHM 1% 1/10W 0603; Order Number: ERJ-3EKF1002V; Package: RESC1608X05N(0603); Distributor: Panasonic
R27 = SMD: Order Number: WSL2512R0100FEA; Value: RES SMD 0.01 OHM 1% 2W 2512; Package: 2512; Distributor: Vishay Dale
U1 = L7805CT: Positive Voltage Regulator; Published: 24-Aug-2001; LatestRevisionDate: 17-Jul-2002; LatestRevisionNote: Re-released for DXP Platform.; DatasheetVersion: Dec-1998; PackageReference: TO-3R; Publisher: Altium Limited; PackageDescription: Oval Flange Mount with (2) Offset Leads; Pin Spacing 10.92 mm; Lead Dia. 1.1 mm (max); ComponentLink1Description: Manufacturer Link; ComponentLink1URL: http://www.st.com/; ComponentLink2Description: Datasheet; ComponentLink2URL: http://www.st.com/stonline/products/literature/ds/2144/l7805ab.pdf
U2 = LM78M05CT: 3-Terminal Positive Voltage Regulators, 3-pin TO-220; Manufacturer: National Semiconductor; PackageTopMarking: NSUZXYTTE#*LM341T-5.0*LM78M05CT; PowerWise: N; CompType: LDO IC; Published: 4-Dec-2008; DatasheetVersion: Aug-2005; PackageVersion: revL, Jan-1992; PackageReference: T03B; Publisher: Altium Limited; PackageDescription: TO-220, Molded, 3 Lead, Straight; Supplier 1: Farnell; Supplier Part Number 1: 4467103; PartNumber: LM78M05CT; RoHS: N; PinCount: 3; ComponentLink1Description: LM78M05 Datasheet; ComponentLink1URL: http://www.national.com/ds/LM/LM78M05.pdf; ComponentLink2Description: LM78M05 Web Page; ComponentLink2URL: http://www.national.com/pf/LM/LM78M05.html; ComponentLink3Description: T03B Package Page; ComponentLink3URL: http://www.national.com/packaging/folders/t03b.html
Z1 = Crystal_smd_with_caps: Value: CER RES 8.0000MHZ 22PF SMD; Order Number: AWSCR-8.00CV-T; Distributor: Abracon LLC; Package: 3-SMD, Non-Standard
J1-J5 = Socket: LatestRevisionDate: 17-Jul-2002; LatestRevisionNote: Re-released for DXP Platform.; Publisher: Altium Limited

## Nets that join several sheets
_CTRL_GND: PowerHalfBridge (15 pins), DriverSPI (15 pins), Controller (29 pins)
1_H_CONTROL: DriverSPI (IC4.17), Controller (IC1.43)
1_L_CONTROL: DriverSPI (IC4.18), Controller (IC1.36)
1_SENSE: DriverSPI (IC4.25), Controller (IC1.27)
2_H_CONTROL: DriverSPI (IC4.19), Controller (R3.1)
2_L_CONTROL: DriverSPI (IC4.20), Controller (IC1.35)
2_SENSE: DriverSPI (IC4.26), Controller (IC1.26)
3_H_CONTROL: DriverSPI (IC4.21), Controller (R2.1)
3_L_CONTROL: DriverSPI (IC4.22), Controller (IC1.34)
_3.3V: DriverSPI (IC4.49), Controller (17 pins)
_AGND: DriverSPI (C32.2 C33.2 IC4.28), Controller (15 pins)
_REF: DriverSPI (C32.1 IC4.24), Controller (9 pins)
BUCK: PowerHalfBridge (Q10.3 R48.1), DriverSPI (L1.2 R31.1), Controller (6 pins)
DC_CAL: DriverSPI (IC4.12), Controller (R8.2)
EN_GATE: DriverSPI (IC4.16), Controller (R7.2)
FAULT: DriverSPI (IC4.6), Controller (IC1.54)
NetC46_2: PowerHalfBridge (8 pins), DriverSPI (D6.1), Controller (R14.1)
NetIC1_14: PowerHalfBridge (R38.1 R39.1), Controller (IC1.14)
NetIC1_15: PowerHalfBridge (R36.1 R37.1), Controller (IC1.15)
NetIC1_16: PowerHalfBridge (R40.1 R41.1), Controller (IC1.16)
NetIC1_62: PowerHalfBridge (R47.1), Controller (IC1.62)
NetNT2_1: PowerHalfBridge (NT2.1), DriverSPI (R32.2)
NetNT3_1: PowerHalfBridge (NT3.1), DriverSPI (R32.4)
NetNT4_1: PowerHalfBridge (NT4.1), DriverSPI (R32.8)
NetNT5_1: PowerHalfBridge (NT5.1), DriverSPI (R32.6)
PHASE_1: PowerHalfBridge (Q3.3 Q4.2 R36.2), DriverSPI (C40.1 IC4.41)
PHASE_2: PowerHalfBridge (Q5.3 Q6.2 R38.2), DriverSPI (C39.1 IC4.46)
PHASE_3: PowerHalfBridge (Q7.3 Q8.2 R40.2), DriverSPI (C38.1 IC4.36)
~{SPI_CS}: DriverSPI (IC4.8), Controller (R4.1)
SPI_MISO: DriverSPI (IC4.10), Controller (IC1.52)
SPI_MOSI: DriverSPI (IC4.9), Controller (IC1.53)
SPI_SCK: DriverSPI (IC4.11), Controller (IC1.51)
UH_P: PowerHalfBridge (R33.1), DriverSPI (IC4.42)
UL_N: PowerHalfBridge (NT2.2 Q4.3 R35.1), DriverSPI (IC4.39)
UL_P: PowerHalfBridge (R34.1), DriverSPI (IC4.40)
VH_P: PowerHalfBridge (R43.1), DriverSPI (IC4.47)
VL_P: PowerHalfBridge (R42.1), DriverSPI (IC4.45)
WH_P: PowerHalfBridge (R45.1), DriverSPI (IC4.37)
WL_N: PowerHalfBridge (NT4.2 Q8.3 R46.1), DriverSPI (IC4.34)
WL_P: PowerHalfBridge (R44.1), DriverSPI (IC4.35)